# Altium schematic sheet 02_IO.SchDoc: =GlobalProjectName
size 594 x 420 mm; CheckedBy: Simon; Author: A_D; SheetNumber: 2; SheetTotal: 2; PageSetup: Record=PageOptions|CenterHorizontal=True|CenterVertical=True|PrintScale=0.70|XCorrection=1.00|YCorrection=1.00|PrintKind=2|BorderSize=5000000|LeftOffset=9000|BottomOffset=10100|Orientation=2|PaperLength=11176|PaperWidth=8636|Scale=100|PaperSource=259|PrintQuality=-3|MediaType=1|DitherType=10|PrintScaleMode=1|PaperKind=A3|PaperIndex=8
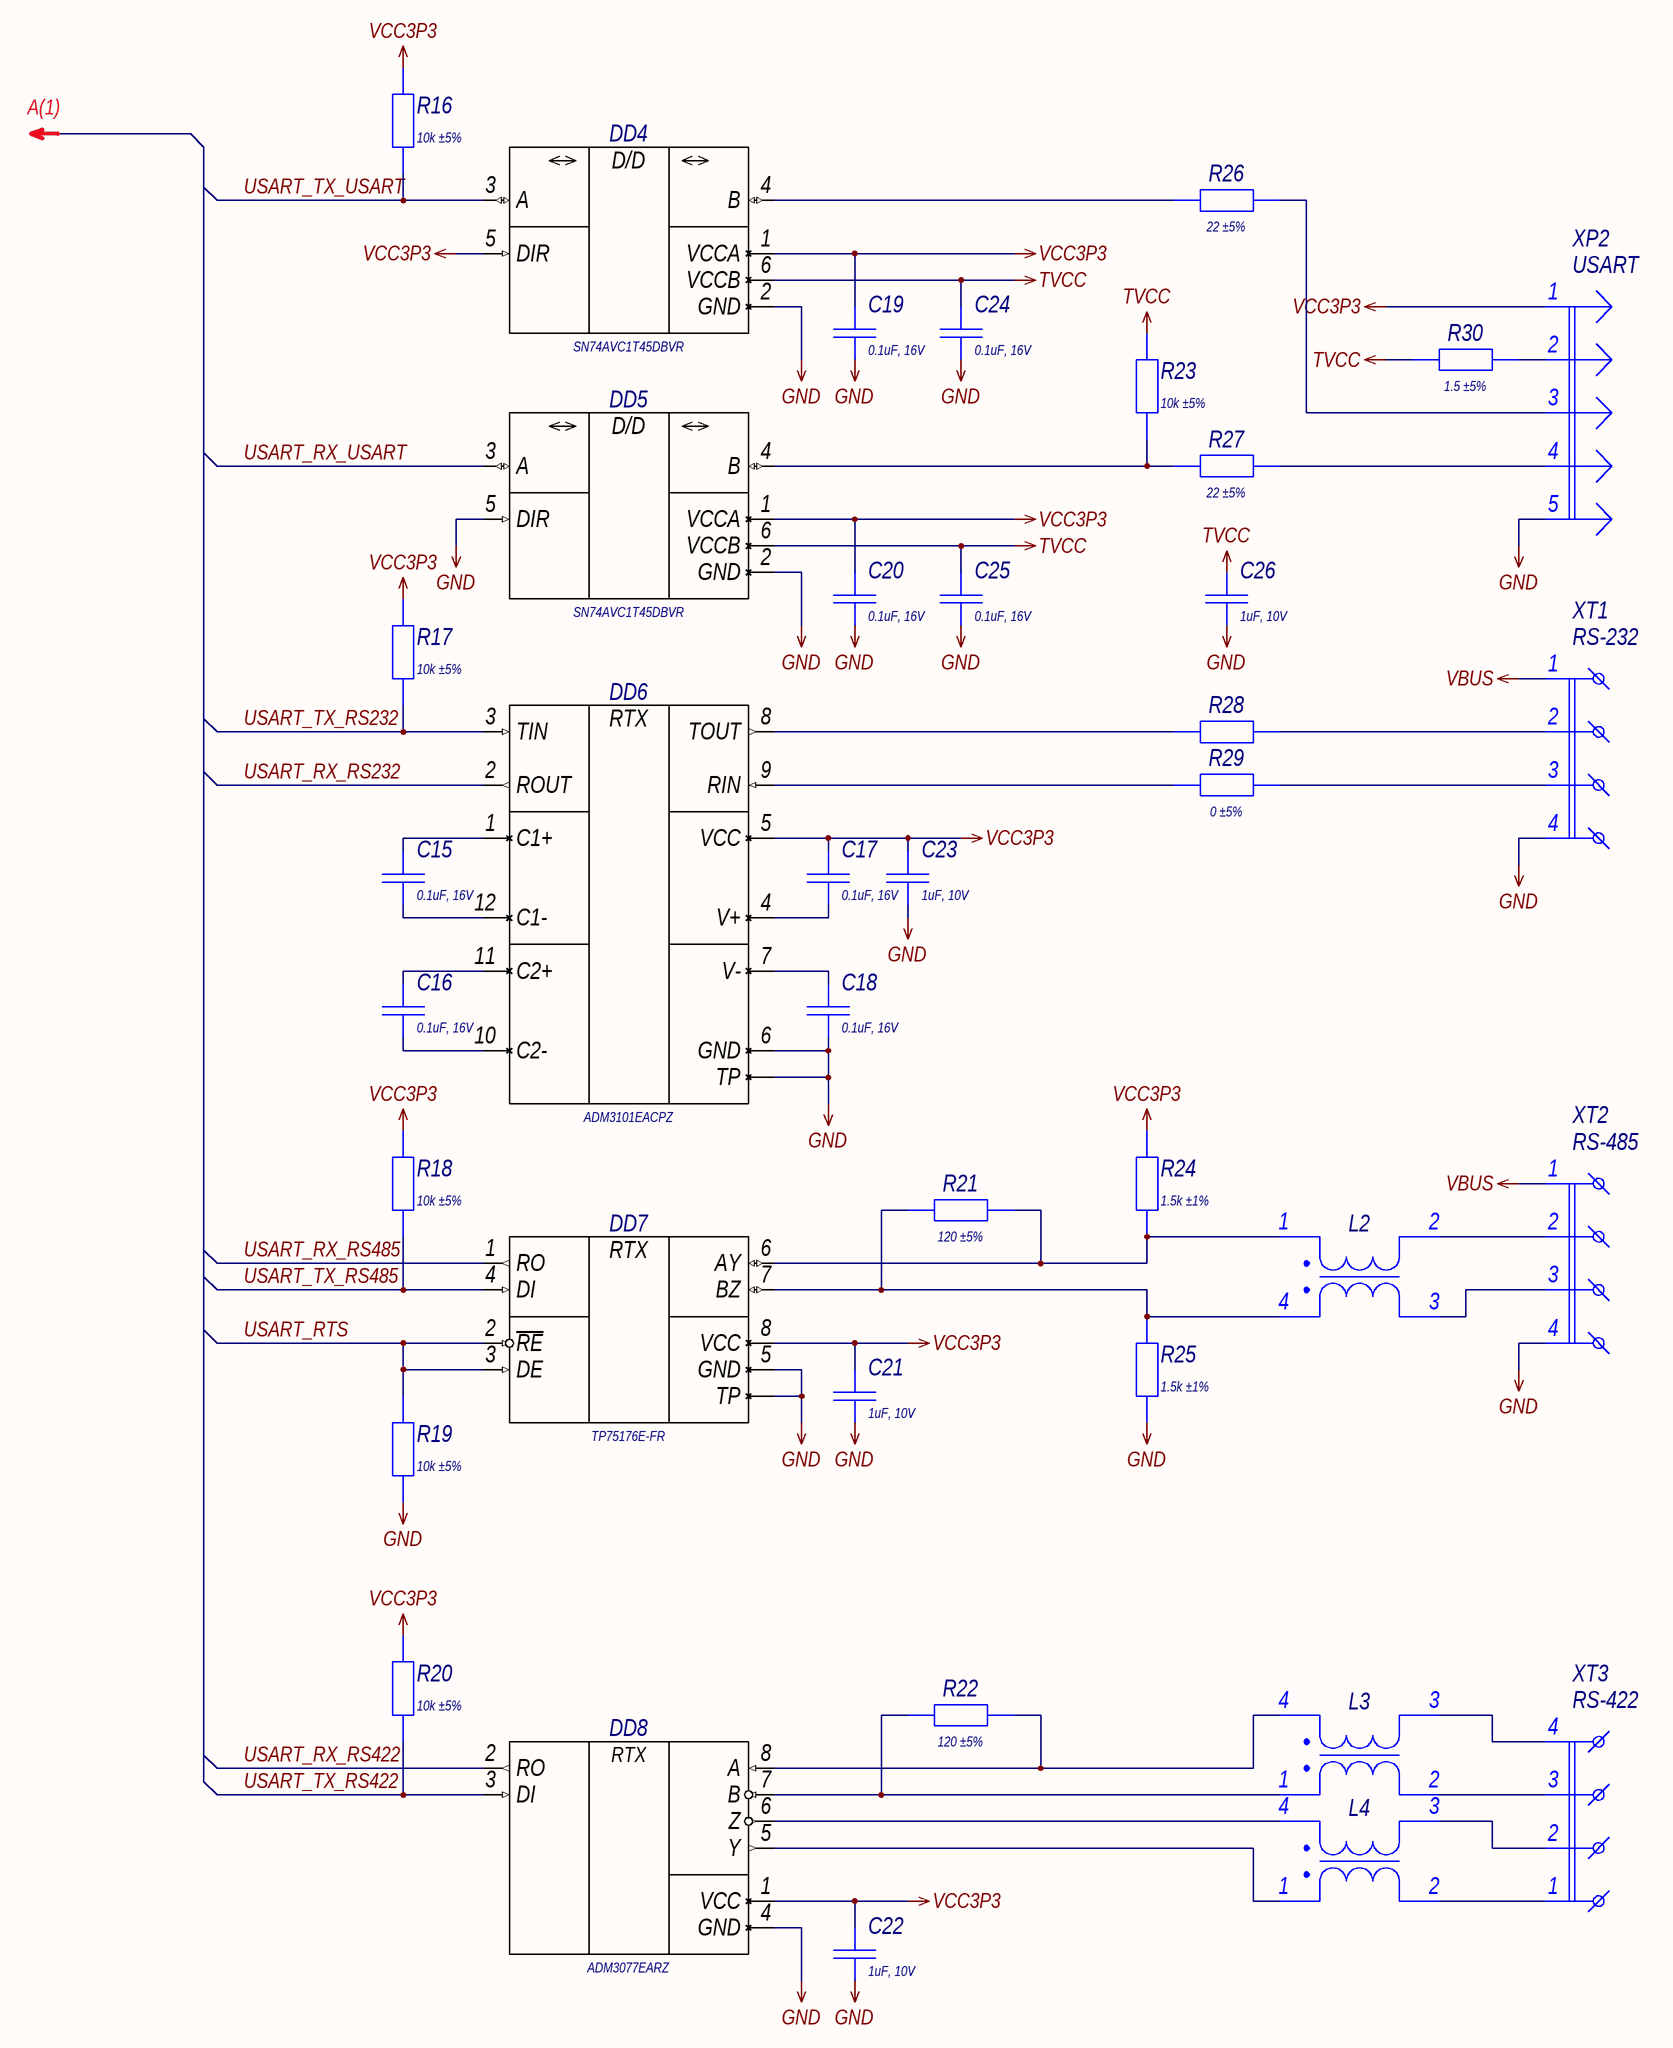
[diagram p0: 02_IO.SchDoc]

## Parts
C15  Schematic Value: 0.1uF, 16V  [C0402_100X050H050_H]  (hidden comment: Capacitor)
C16  Schematic Value: 0.1uF, 16V  [C0402_100X050H050_H]  (hidden comment: Capacitor)
C17  Schematic Value: 0.1uF, 16V  [C0402_100X050H050_H]  (hidden comment: Capacitor)
C18  Schematic Value: 0.1uF, 16V  [C0402_100X050H050_H]  (hidden comment: Capacitor)
C19  Schematic Value: 0.1uF, 16V  [C0402_100X050H050_H]  (hidden comment: Capacitor)
C20  Schematic Value: 0.1uF, 16V  [C0402_100X050H050_H]  (hidden comment: Capacitor)
C21  Schematic Value: 1uF, 10V  [C0402_100X050H050_H]  (hidden comment: Capacitor)
C22  Schematic Value: 1uF, 10V  [C0402_100X050H050_H]  (hidden comment: Capacitor)
C23  Schematic Value: 1uF, 10V  [C0402_100X050H050_H]  (hidden comment: Capacitor)
C24  Schematic Value: 0.1uF, 16V  [C0402_100X050H050_H]  (hidden comment: Capacitor)
C25  Schematic Value: 0.1uF, 16V  [C0402_100X050H050_H]  (hidden comment: Capacitor)
C26  Schematic Value: 1uF, 10V  [C0402_100X050H050_H]  (hidden comment: Capacitor)
DD4  Schematic Value: SN74AVC1T45DBVR  [SOT-23-6_095P290X160X145_N]  (hidden comment: SN74AVC1T45Dx-Series)
DD5  Schematic Value: SN74AVC1T45DBVR  [SOT-23-6_095P290X160X145_N]  (hidden comment: SN74AVC1T45Dx-Series)
DD6  Schematic Value: ADM3101EACPZ  [LFCSP-12_050P300X300X080_N]  (hidden comment: ADM3101EAC)
DD7  TP75176E-FR  [DFN-8_065P300X300X090_N]
DD8  Schematic Value: ADM3077EARZ  [SOIC-8_127P490X391X155_N]  (hidden comment: ADM3077)
L2  Coil-2xCommon_H  [DLW21HN-Series]  (value not drawn)
L3  Coil-2xCommon_H  [DLW21HN-Series]  (value not drawn)
L4  Coil-2xCommon_H  [DLW21HN-Series]  (value not drawn)
R16  Schematic Value: 10k ±5%  [R0402_100X050H035_H]  (hidden comment: Resistor)
R17  Schematic Value: 10k ±5%  [R0402_100X050H035_H]  (hidden comment: Resistor)
R18  Schematic Value: 10k ±5%  [R0402_100X050H035_H]  (hidden comment: Resistor)
R19  Schematic Value: 10k ±5%  [R0402_100X050H035_H]  (hidden comment: Resistor)
R20  Schematic Value: 10k ±5%  [R0402_100X050H035_H]  (hidden comment: Resistor)
R21  Schematic Value: 120 ±5%  [R0603_160X080H045_H]  (hidden comment: Resistor)
R22  Schematic Value: 120 ±5%  [R0603_160X080H045_H]  (hidden comment: Resistor)
R23  Schematic Value: 10k ±5%  [R0402_100X050H035_H]  (hidden comment: Resistor)
R24  Schematic Value: 1.5k ±1%  [R0402_100X050H035_H]  (hidden comment: Resistor)
R25  Schematic Value: 1.5k ±1%  [R0402_100X050H035_H]  (hidden comment: Resistor)
R26  Schematic Value: 22 ±5%  [R0402_100X050H035_H]  (hidden comment: Resistor)
R27  Schematic Value: 22 ±5%  [R0402_100X050H035_H]  (hidden comment: Resistor)
R28  Resistor  [R0402_100X050H035_H]  (value not drawn)
R29  Schematic Value: 0 ±5%  [R0402_100X050H035_H]  (hidden comment: Resistor)
R30  Schematic Value: 1.5 ±5%  [R0402_100X050H035_H]  (hidden comment: Resistor)
XP2  USART  [PLS-5]
XT1  RS-232  [ECH381R-04P]
XT2  RS-485  [ECH381R-04P]
XT3  RS-422  [ECH381R-04P]

## Nets
GND: C18.2 C19.2 C20.2 C21.2 C22.2 C23.2 C24.2 C25.2 C26.2 DD4.2(GND) DD5.2(GND) DD5.5(DIR) DD6.6(GND) DD6.TP DD7.5(GND) DD7.TP DD8.4(GND) R19.1 R25.2 XP2.5 XT1.4 XT2.4
TVCC: C24.1 C25.1 C26.1 DD4.6(VCCB) DD5.6(VCCB) R23.2 R30.2
VBUS: XT1.1 XT2.1
VCC3P3: C17.1 C19.1 C20.1 C21.1 C22.1 C23.1 DD4.1(VCCA) DD4.5(DIR) DD5.1(VCCA) DD6.5(VCC) DD7.8(VCC) DD8.1(VCC) R16.2 R17.2 R18.2 R20.2 R24.1 XP2.1
USART_RTS: DD7.2(~{RE}) DD7.3(DE) R19.2
USART_RX_RS232: DD6.2(ROUT)
USART_RX_RS422: DD8.2(RO)
USART_RX_RS485: DD7.1(RO)
USART_RX_USART: DD5.3(A)
USART_TX_RS232: DD6.3(TIN) R17.1
USART_TX_RS422: DD8.3(DI) R20.1
USART_TX_RS485: DD7.4(DI) R18.1
USART_TX_USART: DD4.3(A) R16.1
NetC15_1: C15.1 DD6.1(C1+)
NetC15_2: C15.2 DD6.12(C1-)
NetC16_1: C16.1 DD6.11(C2+)
NetC16_2: C16.2 DD6.10(C2-)
NetC17_2: C17.2 DD6.4(V+)
NetC18_1: C18.1 DD6.7(V-)
NetDD4_4: DD4.4(B) R26.2
NetDD5_4: DD5.4(B) R23.1 R27.2
NetDD6_8: DD6.8(TOUT) R28.2
NetDD6_9: DD6.9(RIN) R29.2
NetDD7_6: DD7.6(AY) L2.1 R21.2 R24.2
NetDD7_7: DD7.7(BZ) L2.4 R21.1 R25.1
NetDD8_5: DD8.5(Y) L4.1
NetDD8_6: DD8.6(Z) L4.4
NetDD8_7: DD8.7(B) L3.1 R22.1
NetDD8_8: DD8.8(A) L3.4 R22.2
NetL2_2: L2.2 XT2.2
NetL2_3: L2.3 XT2.3
NetL3_2: L3.2 XT3.3
NetL3_3: L3.3 XT3.4
NetL4_2: L4.2 XT3.1
NetL4_3: L4.3 XT3.2
NetR26_1: R26.1 XP2.3
NetR27_1: R27.1 XP2.4
NetR28_1: R28.1 XT1.2
NetR29_1: R29.1 XT1.3
NetR30_1: R30.1 XP2.2

## Notes on the sheet
- А(1)
- Подп. и дата
- Инв. № дубл.
- Взам. инв. №
- Инв. № подл.
- Изм.
- Лист
- № докум.
- Подп.
- Дата
- Форма 2а ГОСТ 2.104-2006
- Копировал
- Формат А2
- (in symbol ADM3077EARZ) RTX
- (in symbol ADM3101EACPZ) RTX
- (in symbol SN74AVC1T45DBVR) D/D
- (in symbol TP75176E-FR) RTX

## Library data of the parts
C15-C20 C24 C25 = GCM155R71C104KA55D: Manufacturer: Murata; Type: Конденсатор; ID: 163; Value: 0.1uF; Voltage: 16V; Tolerance: ±10%; Dielectric Type: X7R; Application Category: 1; Working Temperature Min: -55°С; Working Temperature Max: +125°С; Functional Analog: GRM155R71C104KA88D, GCM155R71C104KA55J, GCM155R71C104KA55W; Published: 18.05.2010; Publisher: Andrew Danich; Part Number: GCM155R71C104KA55D; Footprint: 0402
C21-C23 C26 = GRM155C71A105KE11D: Manufacturer: Murata; Type: Конденсатор; ID: 179; Value: 1uF; Voltage: 10V; Tolerance: ±10%; Dielectric Type: X7S; Application Category: 1; Working Temperature Min: -55°С; Working Temperature Max: +125°С; Functional Analog: GRM155C71A105KE11J; Published: 18.05.2010; Publisher: Andrew Danich; Part Number: GRM155C71A105KE11D; Footprint: 0402
DD4 DD5 = SN74AVC1T45DBVR: Manufacturer: Texas Instruments; ID: 5; Supply 1 Operation: +1.4…3.6V; Supply Current: 10uA; Directional: Bidirection; Channels: 1; Max Data Rate: 500Mbps; Working Temperature Min: -40°С; Working Temperature Max: +85°С; Functional Analog: SN74AVC1T45DBVT; Published: 26.03.2016; Publisher: Andrew Danich; Type: Микросхема; Part Number: SN74AVC1T45DBVR; Value: SN74AVC1T45DBVR; Supply 2 Operation: +1.4…3.6V; LCSC Part: C131978; Application Category: 1
DD6 = ADM3101EACPZ: Manufacturer: Analog Devices; ID: 6; Supply Operation: +3…5.5V; Supply Current: 2.6mA; Interface Levels: +2.0/3.3/5V; Input Interface: UART; Interface Speed: 460kb/s; Application Category: 1; Working Temperature Min: -40°C; Working Temperature Max: +85°C; Published: 07.05.2016; Publisher: Andrew Danich; Type: Микросхема; Part Number: ADM3101EACPZ; Value: ADM3101EACPZ; EEPROM: -; Rx-Tx Buffer Size: -
DD7 = TP75176E-FR: Manufacturer: 3PEAK; ID: 5; Supply Operation: +3.0…5.5V; Supply Current: 300mA; Driver Input Voltage: -9.0…+14.0V; Max Data Rate: 10Mbps; Application Category: 1; Working Temperature Min: -40°С; Working Temperature Max: +125°С; Functional Analog: SIT3088ETK; Published: 03.08.2020; Publisher: Andrew Danich; Type: Микросхема; Schematic Value: TP75176E-FR; Part Number: TP75176E-FR; Value: TP75176E-FR; Driver Output Voltage: -9.0…+14.0V
DD8 = ADM3077EARZ: Manufacturer: Analog Devices; ID: 1; Supply Operation: +4.5…5.5V; Supply Current: 1.5mA; Driver Input Voltage: -8…+13V; Max Data Rate: 16Mbps; Working Temperature Min: -40°С; Working Temperature Max: +85°С; Functional Analog: ADM3077EYRZ; Published: 05.09.2015; Publisher: Andrew Danich; Type: Микросхема; Part Number: ADM3077EARZ; Value: ADM3077EARZ; Driver Output Voltage: -8…+13V; Application Category: 1
L2-L4 = DLW21HN121SQ2L: Manufacturer: Murata; Type: Дроссель; ID: 6; Rated Current: 280mA; Rated Voltage: 50V; Common Mode Impedance at 100MHz: 120ohm; Insulation Resistance: 10meg; DC Resistance: 0.45ohm; Withstand Voltage: 125V; Application Category: 1; Working Temperature Min: -40°С; Working Temperature Max: +85°С; Functional Analog: DLW21HN121SQ2B; Published: 04.09.2015; Publisher: Andrew Danich; Schematic Value: =Inductance+' '+Tolerance+', '+"Rated Current"; Part Number: DLW21HN121SQ2L; Value: DLW21HN121SQ2L; LCSC Part: C113040
R16-R20 R23 = RC0402JR-0710KL: Manufacturer: Yageo; ID: 476; Value: 10k; Limit Voltage: 50V; Tolerance: ±5%; Temperature Coefficient: 100ppm; Total Power Dissipation: 0.1W; Series Type: Thick-Film; Application Category: 1; Working Temperature Min: -55°С; Working Temperature Max: +155°С; Type: Резистор; Published: 24.03.2010; Publisher: Andrew Danich; Part Number: RC0402JR-0710KL; Footprint: 0402; LCSC Part: C25744
R21 R22 = RC0603JR-07120R: Manufacturer: Yageo; ID: 444; Value: 120; Limit Voltage: 50V; Tolerance: ±5%; Temperature Coefficient: 100ppm; Total Power Dissipation: 0.1W; Series Type: Thick-Film; Application Category: 1; Working Temperature Min: -55°С; Working Temperature Max: +155°С; Type: Резистор; Published: 24.03.2010; Publisher: Andrew Danich; Part Number: RC0603JR-07120R; Footprint: 0603
R24 R25 = RC0402FR-071K5L: Manufacturer: Yageo; ID: 617; Value: 1.5k; Limit Voltage: 50V; Tolerance: ±1%; Temperature Coefficient: 100ppm; Total Power Dissipation: 0.1W; Series Type: Thick-Film; Application Category: 1; Working Temperature Min: -55°С; Working Temperature Max: +155°С; Type: Резистор; Published: 24.03.2010; Publisher: Andrew Danich; Part Number: RC0402FR-071K5L; Footprint: 0402
R26 R27 = RC0402JR-0722RL: Manufacturer: Yageo; ID: 630; Value: 22; Limit Voltage: 50V; Tolerance: ±5%; Temperature Coefficient: 100ppm; Total Power Dissipation: 0.1W; Series Type: Thick-Film; Application Category: 1; Working Temperature Min: -55°С; Working Temperature Max: +155°С; Type: Резистор; Published: 24.03.2010; Publisher: Andrew Danich; Part Number: RC0402JR-0722RL; Footprint: 0402
R28 = RC0402JR-070RL: Manufacturer: Yageo; Schematic Value: 0 ±5%; ID: 362; Value: 0; Limit Voltage: 50V; Tolerance: ±5%; Temperature Coefficient: 100ppm; Total Power Dissipation: 0.1W; Series Type: Thick-Film; Application Category: 1; Working Temperature Min: -55°С; Working Temperature Max: +155°С; Type: Резистор; Published: 24.03.2010; Publisher: Andrew Danich; Part Number: RC0402JR-070RL; Footprint: 0402; LCSC Part: C17168
R29 = RC0402JR-070RL: Manufacturer: Yageo; ID: 362; Value: 0; Limit Voltage: 50V; Tolerance: ±5%; Temperature Coefficient: 100ppm; Total Power Dissipation: 0.1W; Series Type: Thick-Film; Application Category: 1; Working Temperature Min: -55°С; Working Temperature Max: +155°С; Type: Резистор; Published: 24.03.2010; Publisher: Andrew Danich; Part Number: RC0402JR-070RL; Footprint: 0402; LCSC Part: C17168
R30 = RC0402JR-071R5L: Manufacturer: Yageo; ID: 363; Value: 1.5; Limit Voltage: 50V; Tolerance: ±5%; Temperature Coefficient: 100ppm; Total Power Dissipation: 0.1W; Series Type: Thick-Film; Application Category: 1; Working Temperature Min: -55°С; Working Temperature Max: +155°С; Type: Резистор; Published: 24.03.2010; Publisher: Andrew Danich; Part Number: RC0402JR-071R5L; Footprint: 0402
XP2 = PLS-5: ID: 4; Value: PLS-5; Limit Voltage: 250V; Limit Current: 3A; Connector Type: Male; Resistance: 15momh; Surface Finish: Gold; Pitch: 2.54mm; Application Category: 1; Published: 07.03.2013; Publisher: Andrew Danich; Type: Вилка; Schematic Value: PLS-5; Part Number: PLS-5; Pins: 5
XT1-XT3 = ECH381R-04P: Manufacturer: Dinkle Enterprise; ID: 19; Limit Voltage: 300V; Limit Current: 8A; Surface Finish: Brass, tin-plated; Pitch: 3.81mm; Application Category: 1; Published: 27.07.2015; Publisher: Andrew Danich; Type: Клеммный соединитель; Schematic Value: ECH381R-04P; Part Number: ECH381R-04P; Value: ECH381R-04P; Pins: 4